# EasyEDA schematic Sheet_2.json
TITLE: Sheet_2; REV: 1.0; Date: 2023-03-07; Sheet: 1/1; Drawn By: venkatakrishnanr; Company: Your Company
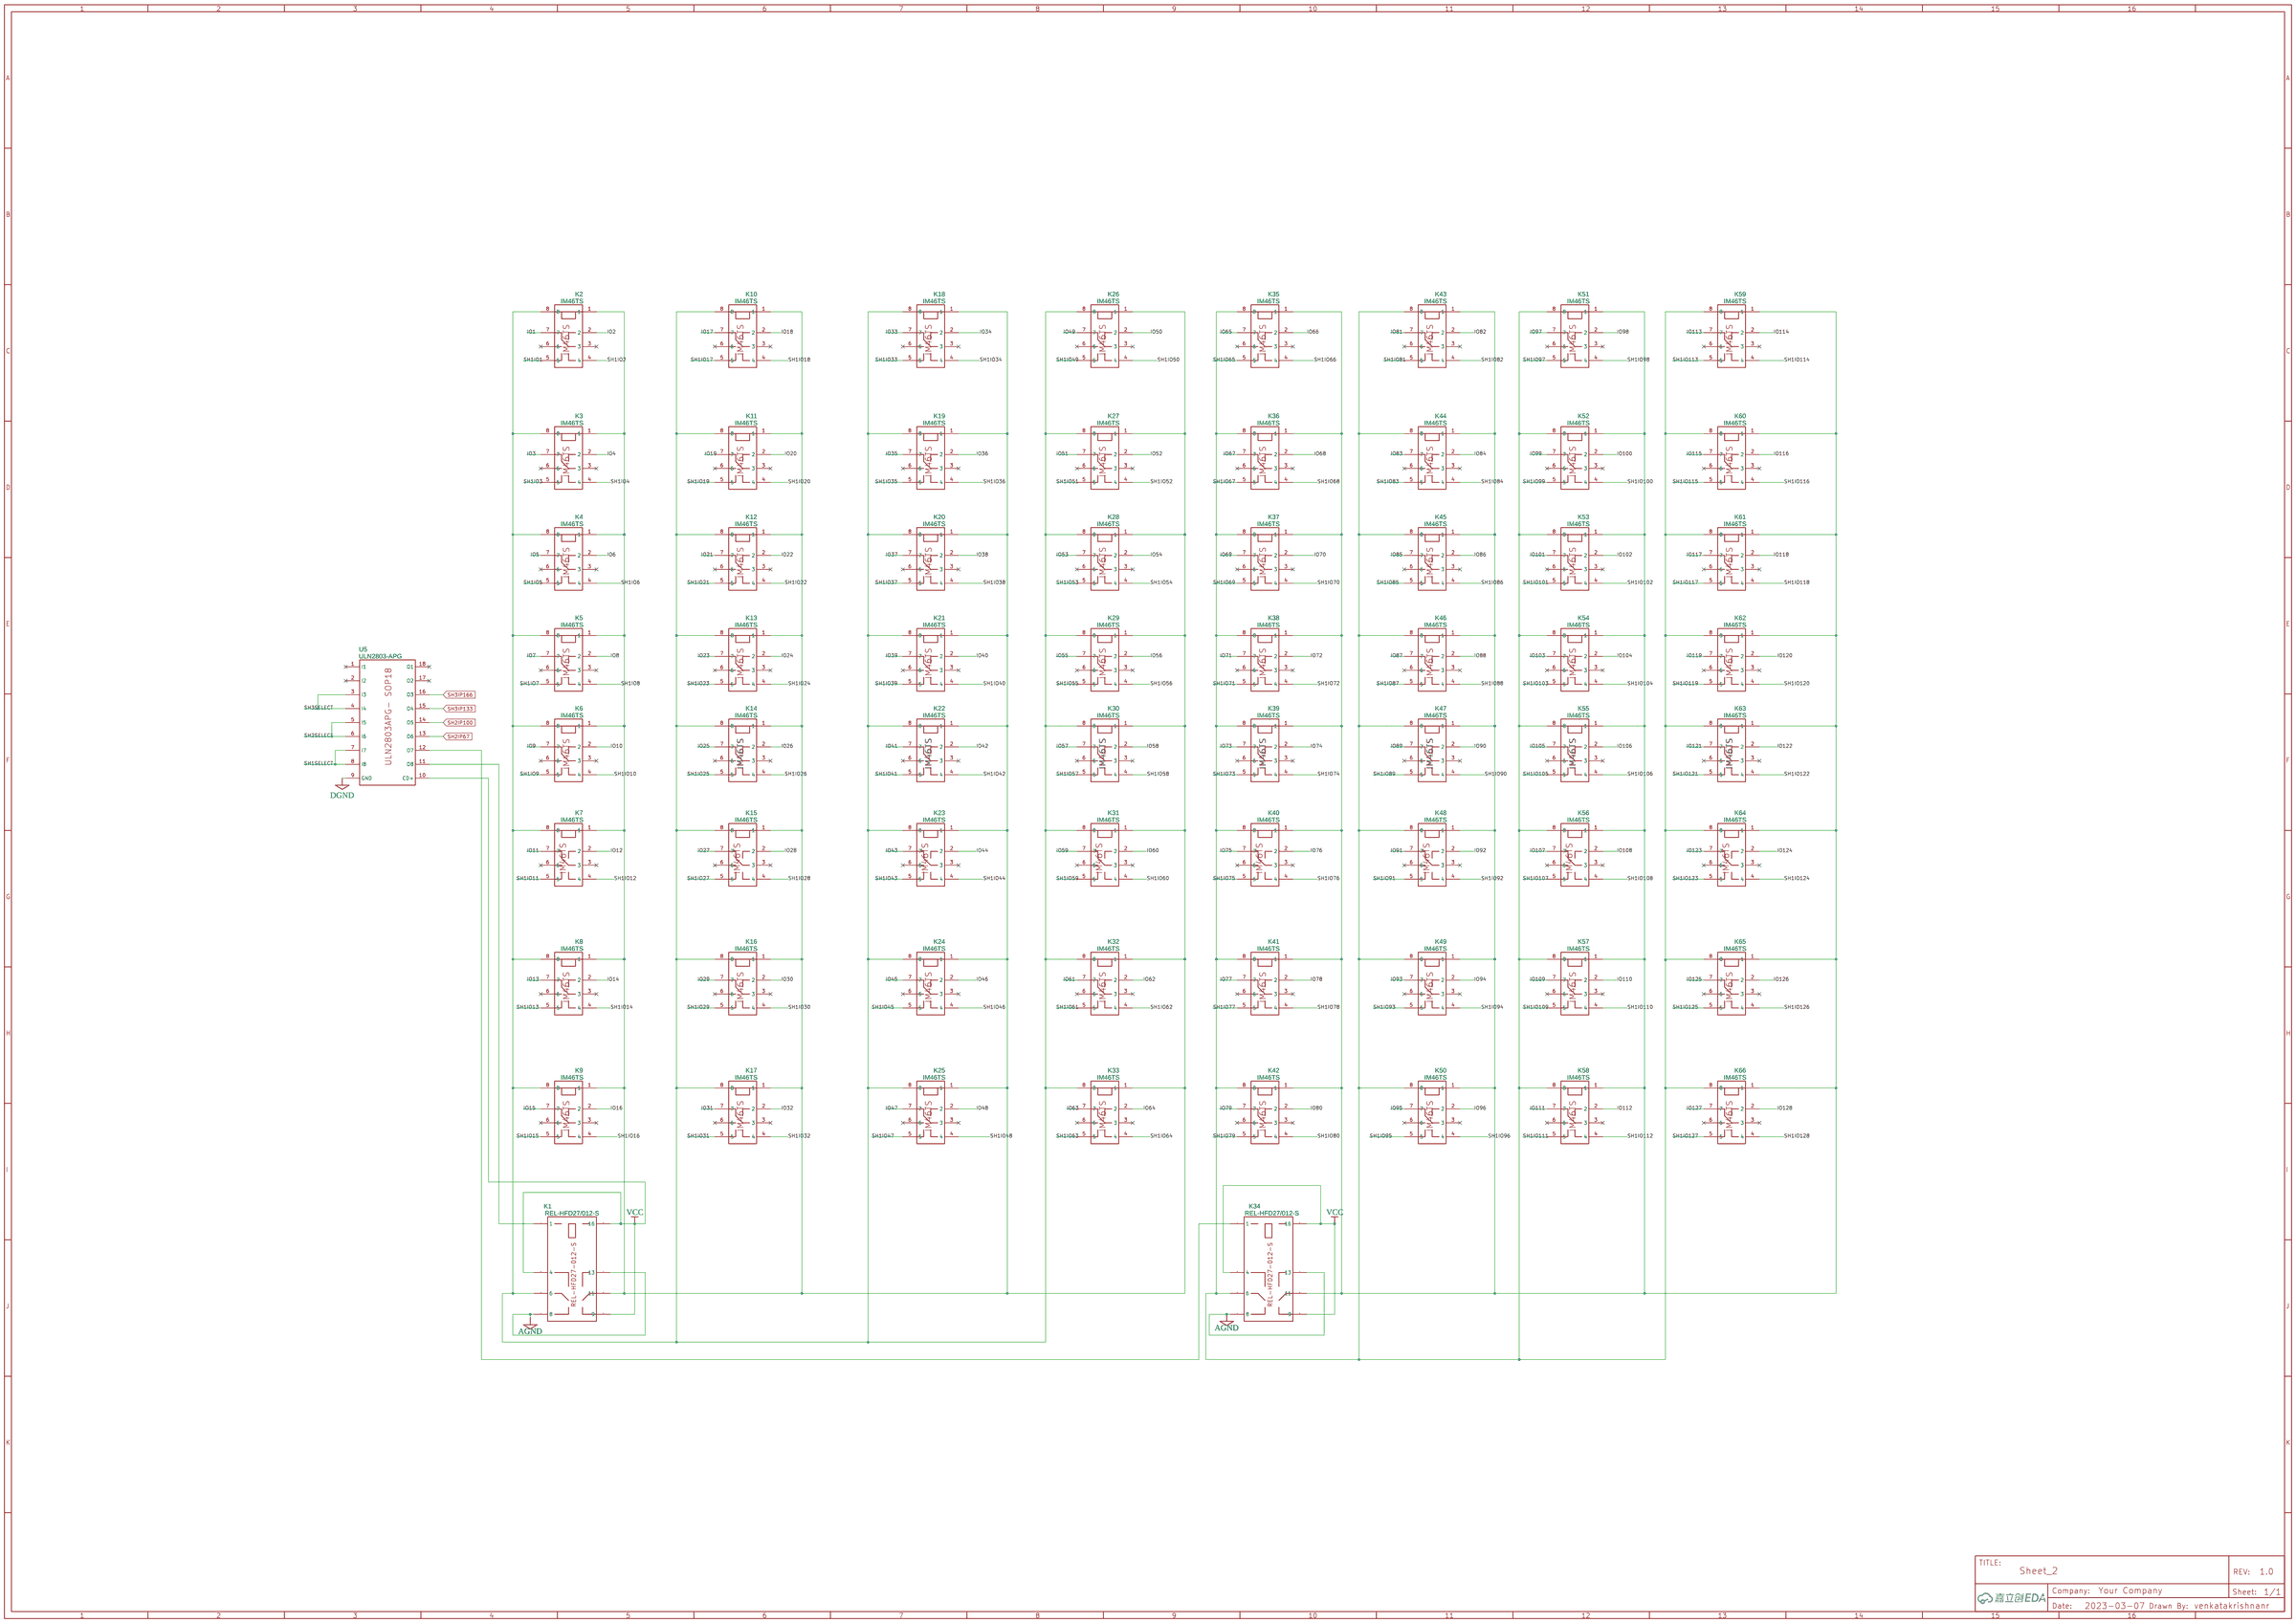
[diagram p0: schematic sheet]

## Parts
K1  REL-HFD27/012-S  [HFD27/012-S- 12VDC]
K2  IM46TS  [SIP_01X08_D0.7MM]
K3  IM46TS  [SIP_01X08_D0.7MM]
K4  IM46TS  [SIP_01X08_D0.7MM]
K5  IM46TS  [SIP_01X08_D0.7MM]
K6  IM46TS  [SIP_01X08_D0.7MM]
K7  IM46TS  [SIP_01X08_D0.7MM]
K8  IM46TS  [SIP_01X08_D0.7MM]
K9  IM46TS  [SIP_01X08_D0.7MM]
K10  IM46TS  [SIP_01X08_D0.7MM]
K11  IM46TS  [SIP_01X08_D0.7MM]
K12  IM46TS  [SIP_01X08_D0.7MM]
K13  IM46TS  [SIP_01X08_D0.7MM]
K14  IM46TS  [SIP_01X08_D0.7MM]
K15  IM46TS  [SIP_01X08_D0.7MM]
K16  IM46TS  [SIP_01X08_D0.7MM]
K17  IM46TS  [SIP_01X08_D0.7MM]
K18  IM46TS  [SIP_01X08_D0.7MM]
K19  IM46TS  [SIP_01X08_D0.7MM]
K20  IM46TS  [SIP_01X08_D0.7MM]
K21  IM46TS  [SIP_01X08_D0.7MM]
K22  IM46TS  [SIP_01X08_D0.7MM]
K23  IM46TS  [SIP_01X08_D0.7MM]
K24  IM46TS  [SIP_01X08_D0.7MM]
K25  IM46TS  [SIP_01X08_D0.7MM]
K26  IM46TS  [SIP_01X08_D0.7MM]
K27  IM46TS  [SIP_01X08_D0.7MM]
K28  IM46TS  [SIP_01X08_D0.7MM]
K29  IM46TS  [SIP_01X08_D0.7MM]
K30  IM46TS  [SIP_01X08_D0.7MM]
K31  IM46TS  [SIP_01X08_D0.7MM]
K32  IM46TS  [SIP_01X08_D0.7MM]
K33  IM46TS  [SIP_01X08_D0.7MM]
K34  REL-HFD27/012-S  [HFD27/012-S- 12VDC]
K35  IM46TS  [SIP_01X08_D0.7MM]
K36  IM46TS  [SIP_01X08_D0.7MM]
K37  IM46TS  [SIP_01X08_D0.7MM]
K38  IM46TS  [SIP_01X08_D0.7MM]
K39  IM46TS  [SIP_01X08_D0.7MM]
K40  IM46TS  [SIP_01X08_D0.7MM]
K41  IM46TS  [SIP_01X08_D0.7MM]
K42  IM46TS  [SIP_01X08_D0.7MM]
K43  IM46TS  [SIP_01X08_D0.7MM]
K44  IM46TS  [SIP_01X08_D0.7MM]
K45  IM46TS  [SIP_01X08_D0.7MM]
K46  IM46TS  [SIP_01X08_D0.7MM]
K47  IM46TS  [SIP_01X08_D0.7MM]
K48  IM46TS  [SIP_01X08_D0.7MM]
K49  IM46TS  [SIP_01X08_D0.7MM]
K50  IM46TS  [SIP_01X08_D0.7MM]
K51  IM46TS  [SIP_01X08_D0.7MM]
K52  IM46TS  [SIP_01X08_D0.7MM]
K53  IM46TS  [SIP_01X08_D0.7MM]
K54  IM46TS  [SIP_01X08_D0.7MM]
K55  IM46TS  [SIP_01X08_D0.7MM]
K56  IM46TS  [SIP_01X08_D0.7MM]
K57  IM46TS  [SIP_01X08_D0.7MM]
K58  IM46TS  [SIP_01X08_D0.7MM]
K59  IM46TS  [SIP_01X08_D0.7MM]
K60  IM46TS  [SIP_01X08_D0.7MM]
K61  IM46TS  [SIP_01X08_D0.7MM]
K62  IM46TS  [SIP_01X08_D0.7MM]
K63  IM46TS  [SIP_01X08_D0.7MM]
K64  IM46TS  [SIP_01X08_D0.7MM]
K65  IM46TS  [SIP_01X08_D0.7MM]
K66  IM46TS  [SIP_01X08_D0.7MM]
U5  ULN2803-APG  [ULN2803APG_SOP18P]

## Library data of the parts
K1 K34 = REL-HFD27/012-S: Contributor: venkatakrishnanr
K2-K33 K35-K66 = IM46TS: Manufacturer: TE Connectivity Potter & Brumfield Relays; Manufacturer Part: 6-1462037-6; Supplier: Digi-Key; Supplier Part: PB2085-ND; link: https://www.digikey.in/en/products/detail/te-connectivity-potter-brumfield-relays/6-1462037-6/2398972?s=N4IgTCBcDaIJYFsAsA2ALgZxAXQL5A; Contributor: venkatakrishnanr
U5 = ULN2803-APG: Manufacturer: Toshiba Semiconductor and Storage; Manufacturer Part: ULN2803APG,CN; Supplier: Digi-Key; Supplier Part: ULN2803APGCN-ND; link: https://www.digikey.in/en/products/detail/toshiba-semiconductor-and-storage/ULN2803APG-CN/856431?s=N4IgTCBcDaIKoBkByYAcAGAzAQQAoHEACEAXQF8g; Contributor: venkatakrishnanr

## Nets
AGND: K1.4(8) K1.7(13) K34.4(8) K34.7(13)
DGND: U5.9(GND)
VCC: K1.2(4) K1.5(9) K1.8(16) K34.2(4) K34.5(9) K34.8(16) U5.10(CD+)
IO1: K2.7
IO2: K2.2
IO3: K3.7
IO4: K3.2
IO5: K4.7
IO6: K4.2
IO7: K5.7
IO8: K5.2
IO9: K6.7
IO10: K6.2
IO11: K7.7
IO12: K7.2
IO13: K8.7
IO14: K8.2
IO15: K9.7
IO16: K9.2
IO17: K10.7
IO18: K10.2
IO19: K11.7
IO20: K11.2
IO21: K12.7
IO22: K12.2
IO23: K13.7
IO24: K13.2
IO25: K14.7
IO26: K14.2
IO27: K15.7
IO28: K15.2
IO29: K16.7
IO30: K16.2
IO31: K17.7
IO32: K17.2
IO33: K18.7
IO34: K18.2
IO35: K19.7
IO36: K19.2
IO37: K20.7
IO38: K20.2
IO39: K21.7
IO40: K21.2
IO41: K22.7
IO42: K22.2
IO43: K23.7
IO44: K23.2
IO45: K24.7
IO46: K24.2
IO47: K25.7
IO48: K25.2
IO49: K26.7
IO50: K26.2
IO51: K27.7
IO52: K27.2
IO53: K28.7
IO54: K28.2
IO55: K29.7
IO56: K29.2
IO57: K30.7
IO58: K30.2
IO59: K31.7
IO60: K31.2
IO61: K32.7
IO62: K32.2
IO63: K33.7
IO64: K33.2
IO65: K35.7
IO66: K35.2
IO67: K36.7
IO68: K36.2
IO69: K37.7
IO70: K37.2
IO71: K38.7
IO72: K38.2
IO73: K39.7
IO74: K39.2
IO75: K40.7
IO76: K40.2
IO77: K41.7
IO78: K41.2
IO79: K42.7
IO80: K42.2
IO81: K43.7
IO82: K43.2
IO83: K44.7
IO84: K44.2
IO85: K45.7
IO86: K45.2
IO87: K46.7
IO88: K46.2
IO89: K47.7
IO90: K47.2
IO91: K48.7
IO92: K48.2
IO93: K49.7
IO94: K49.2
IO95: K50.7
IO96: K50.2
IO97: K51.7
IO98: K51.2
IO99: K52.7
IO100: K52.2
IO101: K53.7
IO102: K53.2
IO103: K54.7
IO104: K54.2
IO105: K55.7
IO106: K55.2
IO107: K56.7
IO108: K56.2
IO109: K57.7
IO110: K57.2
IO111: K58.7
IO112: K58.2
IO113: K59.7
IO114: K59.2
IO115: K60.7
IO116: K60.2
IO117: K61.7
IO118: K61.2
IO119: K62.7
IO120: K62.2
IO121: K63.7
IO122: K63.2
IO123: K64.7
IO124: K64.2
IO125: K65.7
IO126: K65.2
IO127: K66.7
IO128: K66.2
SH1IO1: K2.5
SH1IO2: K2.4
SH1IO3: K3.5
SH1IO4: K3.4
SH1IO5: K4.5
SH1IO6: K4.4
SH1IO7: K5.5
SH1IO8: K5.4
SH1IO9: K6.5
SH1IO10: K6.4
SH1IO11: K7.5
SH1IO12: K7.4
SH1IO13: K8.5
SH1IO14: K8.4
SH1IO15: K9.5
SH1IO16: K9.4
SH1IO17: K10.5
SH1IO18: K10.4
SH1IO19: K11.5
SH1IO20: K11.4
SH1IO21: K12.5
SH1IO22: K12.4
SH1IO23: K13.5
SH1IO24: K13.4
SH1IO25: K14.5
SH1IO26: K14.4
SH1IO27: K15.5
SH1IO28: K15.4
SH1IO29: K16.5
SH1IO30: K16.4
SH1IO31: K17.5
SH1IO32: K17.4
SH1IO33: K18.5
SH1IO34: K18.4
SH1IO35: K19.5
SH1IO36: K19.4
SH1IO37: K20.5
SH1IO38: K20.4
SH1IO39: K21.5
SH1IO40: K21.4
SH1IO41: K22.5
SH1IO42: K22.4
SH1IO43: K23.5
SH1IO44: K23.4
SH1IO45: K24.5
SH1IO46: K24.4
SH1IO47: K25.5
SH1IO48: K25.4
SH1IO49: K26.5
SH1IO50: K26.4
SH1IO51: K27.5
SH1IO52: K27.4
SH1IO53: K28.5
SH1IO54: K28.4
SH1IO55: K29.5
SH1IO56: K29.4
SH1IO57: K30.5
SH1IO58: K30.4
SH1IO59: K31.5
SH1IO60: K31.4
SH1IO61: K32.5
SH1IO62: K32.4
SH1IO63: K33.5
SH1IO64: K33.4
SH1IO65: K35.5
SH1IO66: K35.4
SH1IO67: K36.5
SH1IO68: K36.4
SH1IO69: K37.5
SH1IO70: K37.4
SH1IO71: K38.5
SH1IO72: K38.4
SH1IO73: K39.5
SH1IO74: K39.4
SH1IO75: K40.5
SH1IO76: K40.4
SH1IO77: K41.5
SH1IO78: K41.4
SH1IO79: K42.5
SH1IO80: K42.4
SH1IO81: K43.5
SH1IO82: K43.4
SH1IO83: K44.5
SH1IO84: K44.4
SH1IO85: K45.5
SH1IO86: K45.4
SH1IO87: K46.5
SH1IO88: K46.4
SH1IO89: K47.5
SH1IO90: K47.4
SH1IO91: K48.5
SH1IO92: K48.4
SH1IO93: K49.5
SH1IO94: K49.4
SH1IO95: K50.5
SH1IO96: K50.4
SH1IO97: K51.5
SH1IO98: K51.4
SH1IO99: K52.5
SH1IO100: K52.4
SH1IO101: K53.5
SH1IO102: K53.4
SH1IO103: K54.5
SH1IO104: K54.4
SH1IO105: K55.5
SH1IO106: K55.4
SH1IO107: K56.5
SH1IO108: K56.4
SH1IO109: K57.5
SH1IO110: K57.4
SH1IO111: K58.5
SH1IO112: K58.4
SH1IO113: K59.5
SH1IO114: K59.4
SH1IO115: K60.5
SH1IO116: K60.4
SH1IO117: K61.5
SH1IO118: K61.4
SH1IO119: K62.5
SH1IO120: K62.4
SH1IO121: K63.5
SH1IO122: K63.4
SH1IO123: K64.5
SH1IO124: K64.4
SH1IO125: K65.5
SH1IO126: K65.4
SH1IO127: K66.5
SH1IO128: K66.4
SH1SELECT: U5.7(I7) U5.8(I8)
SH2IP67: U5.13(O6)
SH2IP100: U5.14(O5)
SH2SELECT: U5.5(I5) U5.6(I6)
SH3IP133: U5.15(O4)
SH3IP166: U5.16(O3)
SH3SELECT: U5.3(I3) U5.4(I4)
Net-(K1-1): K1.1 U5.11(O8)
Net-(K1-3): K1.3(6) K2.8 K3.8 K4.8 K5.8 K6.8 K7.8 K8.8 K9.8 K10.8 K11.8 K12.8 K13.8 K14.8 K15.8 K16.8 K17.8 K18.8 K19.8 K20.8 K21.8 K22.8 K23.8 K24.8 K25.8 K26.8 K27.8 K28.8 K29.8 K30.8 K31.8 K32.8 K33.8
Net-(K1-6): K1.6(11) K2.1 K3.1 K4.1 K5.1 K6.1 K7.1 K8.1 K9.1 K10.1 K11.1 K12.1 K13.1 K14.1 K15.1 K16.1 K17.1 K18.1 K19.1 K20.1 K21.1 K22.1 K23.1 K24.1 K25.1 K26.1 K27.1 K28.1 K29.1 K30.1 K31.1 K32.1 K33.1
Net-(K34-1): K34.1 U5.12(O7)
Net-(K34-3): K34.3(6) K35.8 K36.8 K37.8 K38.8 K39.8 K40.8 K41.8 K42.8 K43.8 K44.8 K45.8 K46.8 K47.8 K48.8 K49.8 K50.8 K51.8 K52.8 K53.8 K54.8 K55.8 K56.8 K57.8 K58.8 K59.8 K60.8 K61.8 K62.8 K63.8 K64.8 K65.8 K66.8
Net-(K34-6): K34.6(11) K35.1 K36.1 K37.1 K38.1 K39.1 K40.1 K41.1 K42.1 K43.1 K44.1 K45.1 K46.1 K47.1 K48.1 K49.1 K50.1 K51.1 K52.1 K53.1 K54.1 K55.1 K56.1 K57.1 K58.1 K59.1 K60.1 K61.1 K62.1 K63.1 K64.1 K65.1 K66.1

Not connected (* = marked no-connect by the designer): K2 3* 6*; K3 3* 6*; K4 3* 6*; K5 3* 6*; K6 3* 6*; K7 3* 6*; K8 3* 6*; K9 3* 6*; K10 3* 6*; K11 3* 6*; K12 3* 6*; K13 3* 6*; K14 3* 6*; K15 3* 6*; K16 3* 6*; K17 3* 6*; K18 3* 6*; K19 3* 6*; K20 3* 6*; K21 3* 6*; K22 3* 6*; K23 3* 6*; K24 3* 6*; K25 3* 6*; K26 3* 6*; K27 3* 6*; K28 3* 6*; K29 3* 6*; K30 3* 6*; K31 3* 6*; K32 3* 6*; K33 3* 6*; K35 3* 6*; K36 3* 6*; K37 3* 6*; K38 3* 6*; K39 3* 6*; K40 3* 6*; K41 3* 6*; K42 3* 6*; K43 3* 6*; K44 3* 6*; K45 3* 6*; K46 3* 6*; K47 3* 6*; K48 3* 6*; K49 3* 6*; K50 3* 6*; K51 3* 6*; K52 3* 6*; K53 3* 6*; K54 3* 6*; K55 3* 6*; K56 3* 6*; K57 3* 6*; K58 3* 6*; K59 3* 6*; K60 3* 6*; K61 3* 6*; K62 3* 6*; K63 3* 6*; K64 3* 6*; K65 3* 6*; K66 3* 6*; U5 1(I1)* 2(I2)* 17(O2)* 18(O1)*

## Notes on the sheet
- IM46TS
- IM46TS
- IM46TS
- IM46TS
- IM46TS
- IM46TS
- IM46TS
